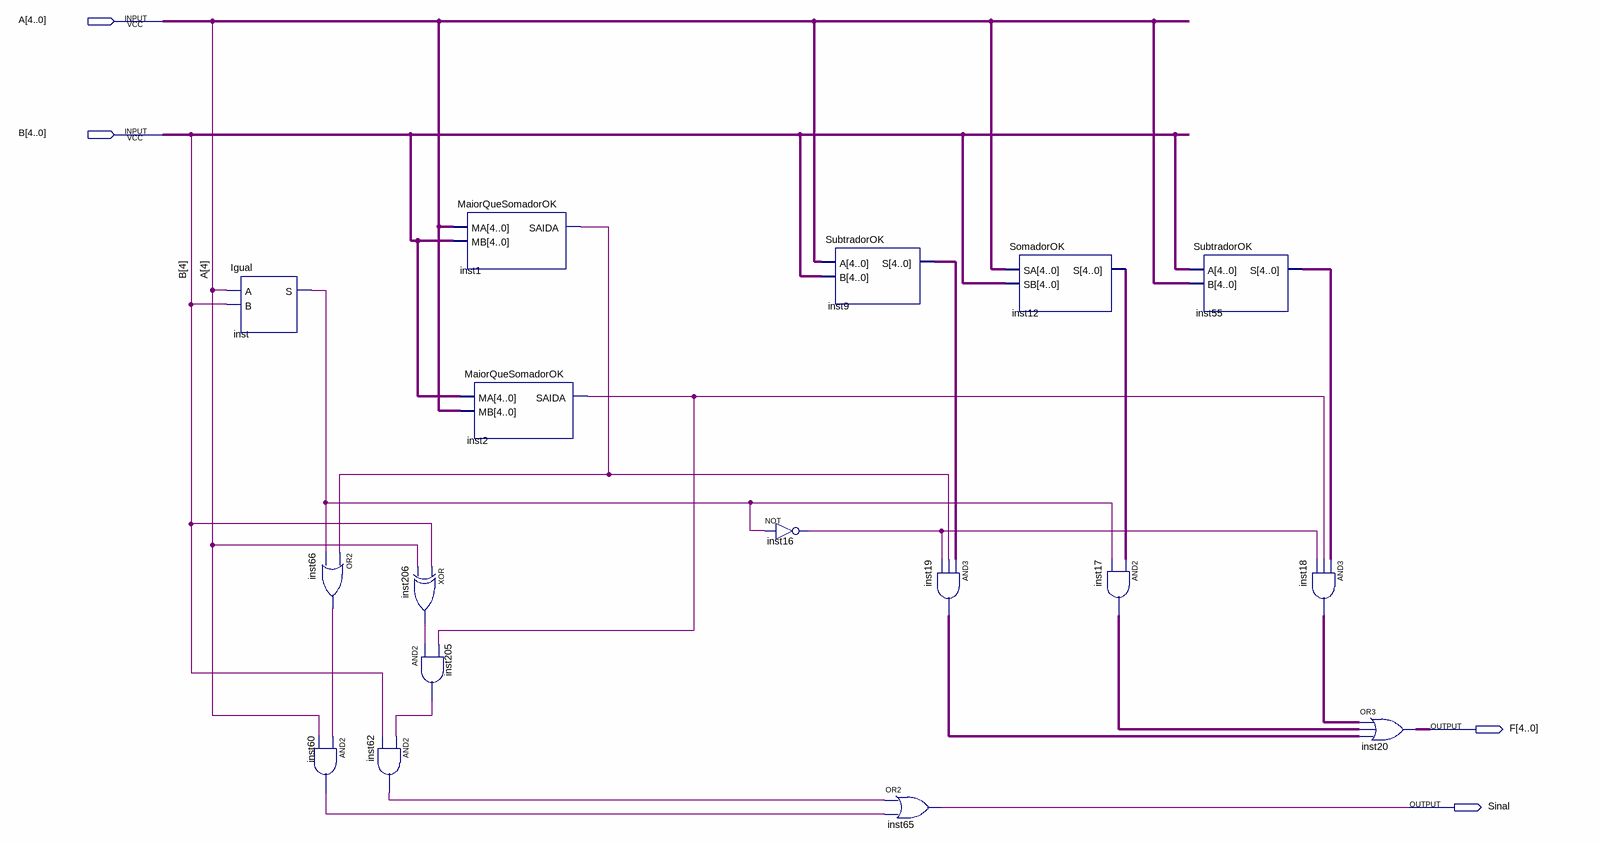
[diagram p0: schematic sheet]
// Quartus schematic SomadorSubtratorOK2.bdf as structural Verilog: 17 symbols, 4 pins
module SomadorSubtratorOK2 (
  input  [4:0] A,
  input  [4:0] B,
  output [4:0] F,
  output Sinal
);

  wire inst1_saida, inst2_saida, inst16_out, inst60_out, inst62_out, inst66_out, inst205_out, inst206_out,
       inst_s;
  wire [4:0] inst9_s, inst12_s, inst17_out, inst18_out, inst19_out, inst55_s;

  Igual inst (.A(A[4]), .B(B[4]), .S(inst_s));
  or inst66 (inst66_out, inst1_saida, inst_s);
  and inst60 (inst60_out, inst66_out, A[4]);
  xor inst206 (inst206_out, B[4], A[4]);
  and inst62 (inst62_out, inst205_out, B[4]);
  MaiorQueSomadorOK inst1 (.MA(A), .MB(B), .SAIDA(inst1_saida));
  MaiorQueSomadorOK inst2 (.MA(B), .MB(A), .SAIDA(inst2_saida));
  and inst205 (inst205_out, inst206_out, inst2_saida);
  not inst16 (inst16_out, inst_s);
  SubtradorOK inst9 (.A(A), .B(B), .S(inst9_s));
  or inst65 (Sinal, inst62_out, inst60_out);
  assign inst19_out = inst9_s & {5{inst1_saida}} & {5{inst16_out}};  // AND3 inst19, 5 bits wide
  SomadorOK inst12 (.SA(A), .SB(B), .S(inst12_s));
  assign inst17_out = inst12_s & {5{inst_s}};  // AND2 inst17, 5 bits wide
  SubtradorOK inst55 (.A(B), .B(A), .S(inst55_s));
  assign inst18_out = inst55_s & {5{inst2_saida}} & {5{inst16_out}};  // AND3 inst18, 5 bits wide
  assign F = inst18_out | inst17_out | inst19_out;  // OR3 inst20, 5 bits wide
endmodule
